# Altium schematic sheet USB_Debug.SchDoc: Dahlia Carrier Board
size A3; Organization: Toradex AG; Address1: Ebenaustrasse 10; Address2: Horw; Address3: 6048; Address4: Switzerland; DocumentNumber: 19; Revision: V1.1; SheetNumber: 19; SheetTotal: 21; PageSetup: Record=PageOptions|CenterHorizontal=True|CenterVertical=True|PrintScale=0.71|XCorrection=1.00|YCorrection=1.00|PrintKind=1|BorderSize=5000000|LeftOffset=0|BottomOffset=0|Orientation=2|PaperLength=1000|PaperWidth=1000|Scale=100|PaperSource=15|PrintQuality=600|MediaType=1|DitherType=10|PaperKind=A4|PrintScaleMode=1
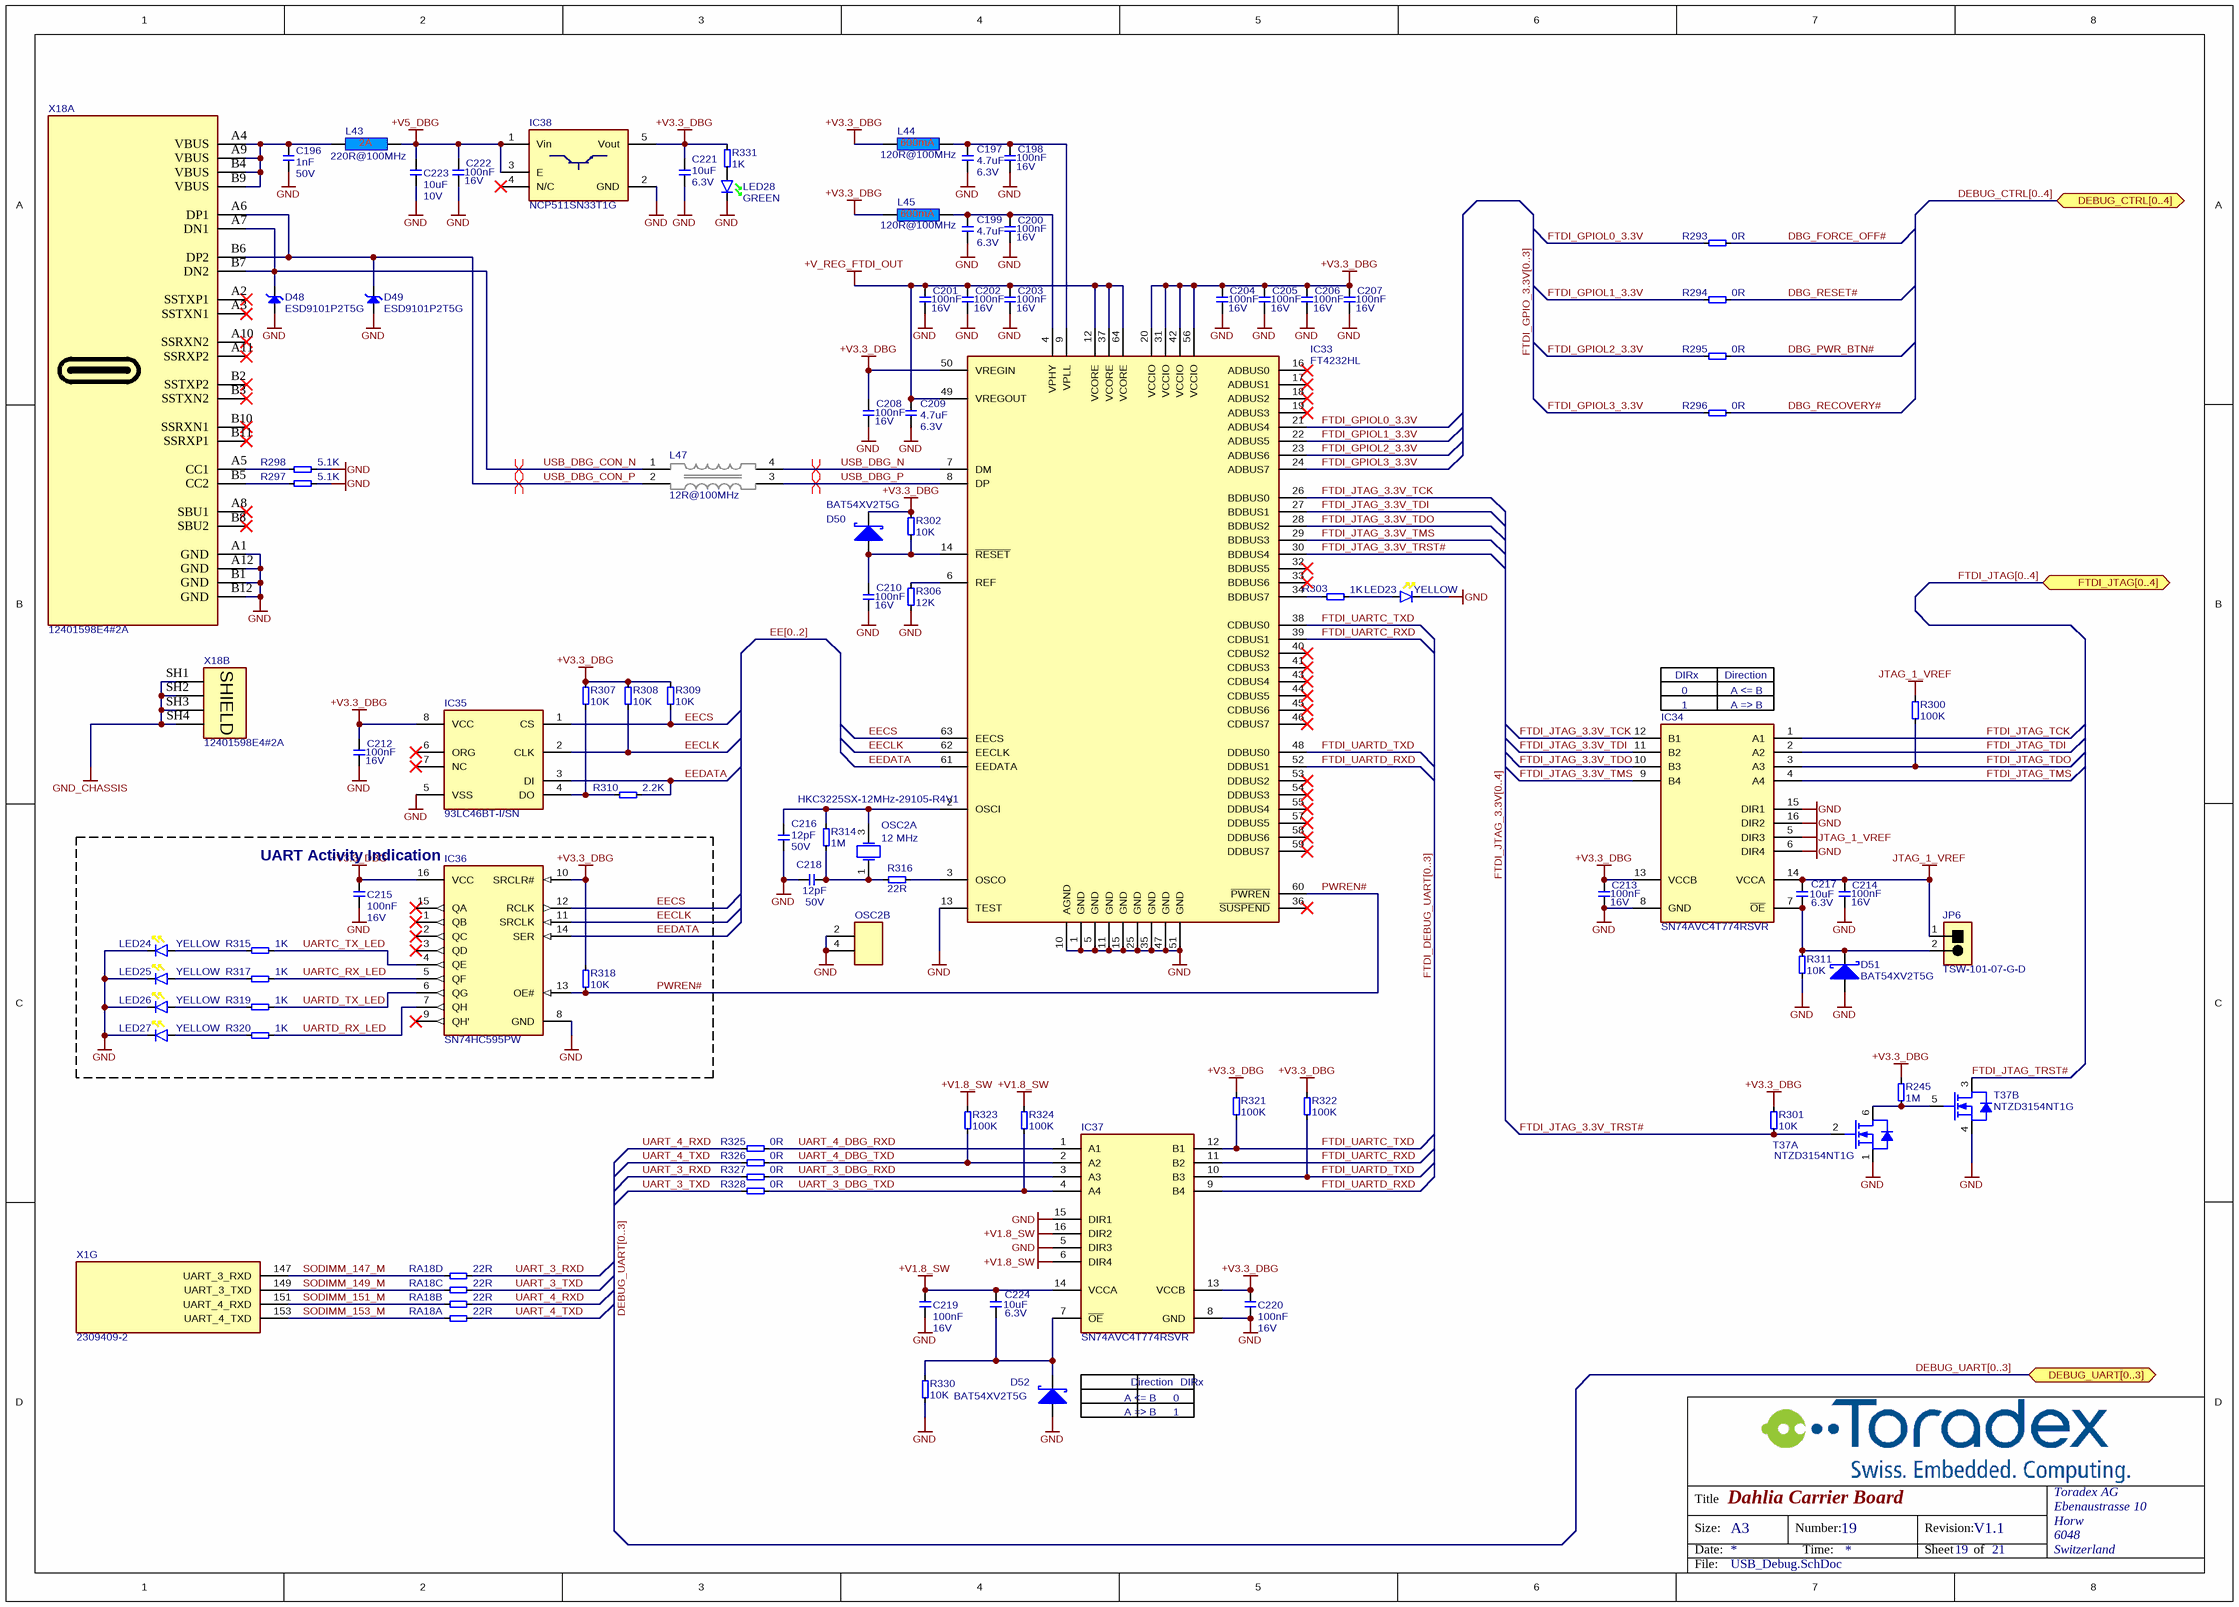
[diagram p0: USB_Debug.SchDoc]

## Parts
C196  Rating: 50V  [CAPC1005X60N]  (hidden comment: 1nF)
C197  Rating: 6.3V  [CAPC1005X60N]  (hidden comment: 4.7uF)
C198  Rating: 16V  [CAPC1005X60N]  (hidden comment: 100nF)
C199  Rating: 6.3V  [CAPC1005X60N]  (hidden comment: 4.7uF)
C200  Rating: 16V  [CAPC1005X60N]  (hidden comment: 100nF)
C201  Rating: 16V  [CAPC1005X60N]  (hidden comment: 100nF)
C202  Rating: 16V  [CAPC1005X60N]  (hidden comment: 100nF)
C203  Rating: 16V  [CAPC1005X60N]  (hidden comment: 100nF)
C204  Rating: 16V  [CAPC1005X60N]  (hidden comment: 100nF)
C205  Rating: 16V  [CAPC1005X60N]  (hidden comment: 100nF)
C206  Rating: 16V  [CAPC1005X60N]  (hidden comment: 100nF)
C207  Rating: 16V  [CAPC1005X60N]  (hidden comment: 100nF)
C208  Rating: 16V  [CAPC1005X60N]  (hidden comment: 100nF)
C209  Rating: 6.3V  [CAPC1005X60N]  (hidden comment: 4.7uF)
C210  Rating: 16V  [CAPC1005X60N]  (hidden comment: 100nF)
C212  Rating: 16V  [CAPC1005X60N]  (hidden comment: 100nF)
C213  Rating: 16V  [CAPC1005X60N]  (hidden comment: 100nF)
C214  Rating: 16V  [CAPC1005X60N]  (hidden comment: 100nF)
C215  Rating: 16V  [CAPC1005X60N]  (hidden comment: 100nF)
C216  Rating: 50V  [CAPC1005X60N]  (hidden comment: 12pF)
C217  Rating: 6.3V  [CAPC1005X60N]  (hidden comment: 10uF)
C218  Rating: 50V  [CAPC1005X60N]  (hidden comment: 12pF)
C219  Rating: 16V  [CAPC1005X60N]  (hidden comment: 100nF)
C220  Rating: 16V  [CAPC1005X60N]  (hidden comment: 100nF)
C221  Rating: 6.3V  [CAPC1005X60N]  (hidden comment: 10uF)
C222  Rating: 16V  [CAPC1005X60N]  (hidden comment: 100nF)
C223  Rating: 10V  [T_CAPC0603X33N]  (hidden comment: 10uF)
C224  Rating: 6.3V  [CAPC1005X60N]  (hidden comment: 10uF)
D48  ESD9101P2T5G  [SOD-923]
D49  ESD9101P2T5G  [SOD-923]
D50  BAT54XV2T5G  [SOD-523]
D51  BAT54XV2T5G  [SOD-523]
D52  BAT54XV2T5G  [SOD-523]
IC33  FT4232HL  [LQFP-64]
IC34  SN74AVC4T774RSVR  [IC-UQFN40P180X210X55-16N]
IC35  Manufacturer Part No.: 93LC46BT-I/SN  [SOIC127P600X173-8N]  (hidden comment: 93LC46BT)
IC36  SN74HC595PW  [IC_TSOP65P640X120-16N]
IC37  SN74AVC4T774RSVR  [IC-UQFN40P180X210X55-16N]
IC38  NCP511SN33T1G  [SOT95P279X142-5N]
JP6  TSW-101-07-G-D  [T_Samtec_TSW-101-07-G-D]
L43  220R@100MHz  [INDC1608X95N]
L44  120R@100MHz  [INDC1005X60N]
L45  120R@100MHz  [INDC1005X60N]
L47  12R@100MHz  [T_Panasonic_EXC14CH120U]
LED23  Color: YELLOW  [T_Liteon_LTST-C190KSKT]  (hidden comment: LTST-C190KSKT)
LED24  Color: YELLOW  [T_Liteon_LTST-C190KSKT]  (hidden comment: LTST-C190KSKT)
LED25  Color: YELLOW  [T_Liteon_LTST-C190KSKT]  (hidden comment: LTST-C190KSKT)
LED26  Color: YELLOW  [T_Liteon_LTST-C190KSKT]  (hidden comment: LTST-C190KSKT)
LED27  Color: YELLOW  [T_Liteon_LTST-C190KSKT]  (hidden comment: LTST-C190KSKT)
LED28  Color: GREEN  [T_Liteon_LTST-C190GKT]  (hidden comment: LTST-C190GKT)
OSC2  HKC3225SX-12MHz-29105-R4V1  value 12 MHz  [OSC-SMD-3.2mmx2.5mm]  (parts A,B of 2)
R245  1M  [RESC1005X40N]
R293  0R  [T_RESC0603X30N]
R294  0R  [T_RESC0603X30N]
R295  0R  [T_RESC0603X30N]
R296  0R  [T_RESC0603X30N]
R297  5.1K  [T_RESC0603X30N]
R298  5.1K  [T_RESC0603X30N]
R300  100K  [RESC1005X40N]
R301  10K  [RESC1005X40N]
R302  10K  [RESC1005X40N]
R303  1K  [RESC1005X40N]
R306  12K  [RESC1005X40N]
R307  10K  [RESC1005X40N]
R308  10K  [RESC1005X40N]
R309  10K  [RESC1005X40N]
R310  2.2K  [RESC1005X40N]
R311  10K  [RESC1005X40N]
R314  value 1M  [T_RESC0603X30N]  (hidden comment: 1MR)
R315  1K  [RESC1005X40N]
R316  22R  [RESC1005X40N]
R317  1K  [RESC1005X40N]
R318  10K  [RESC1005X40N]
R319  1K  [RESC1005X40N]
R320  1K  [RESC1005X40N]
R321  100K  [RESC1005X40N]
R322  100K  [RESC1005X40N]
R323  100K  [RESC1005X40N]
R324  100K  [RESC1005X40N]
R325  0R  [T_RESC0603X30N]
R326  0R  [T_RESC0603X30N]
R327  0R  [T_RESC0603X30N]
R328  0R  [T_RESC0603X30N]
R330  10K  [RESC1005X40N]
R331  1K  [RESC1005X40N]
RA18  22R  [T_Resistor_Array_X4]  (parts A,B,C,D of 4)
T37  Manufacturer Part No.: NTZD3154NT1G  [SOTFL50P160X60-6N]  (hidden comment: T-ONSemi-NTZD3154NT1G)  (parts A,B of 2)
X1  2309409-2  [CON-TE-2309409-2-SOLDERABLE-STANDOFFS]  (part G of 23)
X18  12401598E4#2A  [CON-AMPHENOL-12401598E4#2A]  (parts A,B of 2)

## Blocks framed on the sheet
UART Activity Indication: C215 IC36 LED24-LED27 R315 R317-R320

## Ports
DEBUG_CTRL[0..4] (bidir), DEBUG_UART[0..3] (bidir), FTDI_JTAG[0..4] (bidir)

## Nets
+V1.8_SW: C219.2 C224.2 IC37.6(DIR4) IC37.14(VCCA) IC37.16(DIR2) R323.1 R324.2
+V3.3_DBG: C204.2 C205.2 C206.2 C207.2 C208.2 C212.2 C213.2 C215.2 C220.2 C221.2 D50.C IC33.20(VCCIO) IC33.31(VCCIO) IC33.42(VCCIO) IC33.50(VREGIN) IC33.56(VCCIO) IC34.13(VCCB) IC35.8(VCC) IC36.10(SRCLR#) IC36.16(VCC) IC37.13(VCCB) IC38.5(Vout) L44.1 L45.1 R245.2 R301.2 R302.2 R307.2 R308.2 R309.2 R318.2 R321.1 R322.2 R331.2
+V5_DBG: C222.2 C223.2 IC38.1(Vin) IC38.3(E) L43.1
+V_REG_FTDI_OUT: C201.2 C202.2 C203.2 C209.2 IC33.12(VCORE) IC33.37(VCORE) IC33.49(VREGOUT) IC33.64(VCORE)
GND: C196.1 C197.1 C198.1 C199.1 C200.1 C201.1 C202.1 C203.1 C204.1 C205.1 C206.1 C207.1 C208.1 C209.1 C210.1 C212.1 C213.1 C214.1 C215.1 C216.2 C218.1 C219.1 C220.1 C221.1 C222.1 C223.1 D48.2(A) D49.2(A) D51.A D52.A IC33.1(GND) IC33.5(GND) IC33.10(AGND) IC33.11(GND) IC33.13(TEST) IC33.15(GND) IC33.25(GND) IC33.35(GND) IC33.47(GND) IC33.51(GND) IC34.6(DIR4) IC34.8(GND) IC34.15(DIR1) IC34.16(DIR2) IC35.5(VSS) IC36.8(GND) IC37.5(DIR3) IC37.8(GND) IC37.15(DIR1) IC38.2(GND) LED23.K LED24.K LED25.K LED26.K LED27.K LED28.K OSC2.2(OSC2) OSC2.4(OSC3) R297.1 R298.1 R306.1 R311.1 R330.1 T37.1(S) T37.4(S) X18.A1(GND) X18.A12(GND) X18.B1(GND) X18.B12(GND)
GND_CHASSIS: X18.SH1(SHIELD) X18.SH2(SHIELD) X18.SH3(SHIELD) X18.SH4(SHIELD)
JTAG_1_VREF: C214.2 C217.2 IC34.5(DIR3) IC34.14(VCCA) JP6.1 R300.2
DBG_FORCE_OFF#: R293.2
DBG_PWR_BTN#: R295.2
DBG_RECOVERY#: R296.2
DBG_RESET#: R294.2
EECLK: IC33.62(EECLK) IC35.2(CLK) IC36.11(SRCLK) R308.1
EECS: IC33.63(EECS) IC35.1(CS) IC36.12(RCLK) R309.1
EEDATA: IC33.61(EEDATA) IC35.3(DI) IC36.14(SER) R310.2
FTDI_GPIOL0_3.3V: IC33.21(ADBUS4) R293.1
FTDI_GPIOL1_3.3V: IC33.22(ADBUS5) R294.1
FTDI_GPIOL2_3.3V: IC33.23(ADBUS6) R295.1
FTDI_GPIOL3_3.3V: IC33.24(ADBUS7) R296.1
FTDI_JTAG_3.3V_TCK: IC33.26(BDBUS0) IC34.12(B1)
FTDI_JTAG_3.3V_TDI: IC33.27(BDBUS1) IC34.11(B2)
FTDI_JTAG_3.3V_TDO: IC33.28(BDBUS2) IC34.10(B3)
FTDI_JTAG_3.3V_TMS: IC33.29(BDBUS3) IC34.9(B4)
FTDI_JTAG_3.3V_TRST#: IC33.30(BDBUS4) R301.1 T37.2(G)
FTDI_JTAG_TCK: IC34.1(A1)
FTDI_JTAG_TDI: IC34.2(A2)
FTDI_JTAG_TDO: IC34.3(A3) R300.1
FTDI_JTAG_TMS: IC34.4(A4)
FTDI_JTAG_TRST#: T37.3(D)
FTDI_UARTC_RXD: IC33.39(CDBUS1) IC37.11(B2)
FTDI_UARTC_TXD: IC33.38(CDBUS0) IC37.12(B1) R321.2
FTDI_UARTD_RXD: IC33.52(DDBUS1) IC37.9(B4)
FTDI_UARTD_TXD: IC33.48(DDBUS0) IC37.10(B3) R322.1
PWREN#: IC33.60(~{PWREN}) IC36.13(OE#) R318.1
SODIMM_147_M: RA18.4 X1.147(UART_3_RXD)
SODIMM_149_M: RA18.3 X1.149(UART_3_TXD)
SODIMM_151_M: RA18.2 X1.151(UART_4_RXD)
SODIMM_153_M: RA18.1 X1.153(UART_4_TXD)
UART_3_DBG_RXD: IC37.3(A3) R327.2
UART_3_DBG_TXD: IC37.4(A4) R324.1 R328.2
UART_3_RXD: R327.1 RA18.8
UART_3_TXD: R328.1 RA18.7
UART_4_DBG_RXD: IC37.1(A1) R325.2
UART_4_DBG_TXD: IC37.2(A2) R323.2 R326.2
UART_4_RXD: R325.1 RA18.6
UART_4_TXD: R326.1 RA18.5
UARTC_RX_LED: IC36.5(QF) R317.2
UARTC_TX_LED: IC36.4(QE) R315.2
UARTD_RX_LED: IC36.7(QH) R320.2
UARTD_TX_LED: IC36.6(QG) R319.2
USB_DBG_CON_N: D48.1(C) L47.1 X18.A7(DN1) X18.B7(DN2)
USB_DBG_CON_P: D49.1(C) L47.2 X18.A6(DP1) X18.B6(DP2)
USB_DBG_N: IC33.7(DM) L47.4
USB_DBG_P: IC33.8(DP) L47.3
NetC196_2: C196.2 L43.2 X18.A4(VBUS) X18.A9(VBUS) X18.B4(VBUS) X18.B9(VBUS)
NetC197_2: C197.2 C198.2 IC33.9(VPLL) L44.2
NetC199_2: C199.2 C200.2 IC33.4(VPHY) L45.2
NetC210_2: C210.2 D50.A IC33.14(~{RESET}) R302.1
NetC216_1: C216.1 IC33.2(OSCI) OSC2.3(OSC2) R314.2
NetC217_1: C217.1 D51.C IC34.7(~{OE}) JP6.2 R311.2
NetC218_2: C218.2 OSC2.1(OSC1) R314.1 R316.2
NetC224_1: C224.1 D52.C IC37.7(~{OE}) R330.2
NetIC33_3: IC33.3(OSCO) R316.1
NetIC33_6: IC33.6(REF) R306.2
NetIC33_34: IC33.34(BDBUS7) R303.2
NetIC35_4: IC35.4(DO) R307.1 R310.1
NetLED23_A: LED23.A R303.1
NetLED24_A: LED24.A R315.1
NetLED25_A: LED25.A R317.1
NetLED26_A: LED26.A R319.1
NetLED27_A: LED27.A R320.1
NetLED28_A: LED28.A R331.1
NetR245_1: R245.1 T37.5(G) T37.6(D)
NetR297_2: R297.2 X18.B5(CC2)
NetR298_2: R298.2 X18.A5(CC1)

Not connected (* = marked no-connect by the designer): IC33 16(ADBUS0)* 17(ADBUS1)* 18(ADBUS2)* 19(ADBUS3)* 32(BDBUS5)* 33(BDBUS6)* 36(~{SUSPEND})* 40(CDBUS2)* 41(CDBUS3)* 43(CDBUS4)* 44(CDBUS5)* 45(CDBUS6)* 46(CDBUS7)* 53(DDBUS2)* 54(DDBUS3)* 55(DDBUS4)* 57(DDBUS5)* 58(DDBUS6)* 59(DDBUS7)*; IC35 6(ORG)* 7(NC)*; IC36 1(QB)* 2(QC)* 3(QD)* 9(QH')* 15(QA)*; IC38 4(N/C)*; X18 A2(SSTXP1)* A3(SSTXN1)* A8(SBU1)* A10(SSRXN2)* A11(SSRXP2)* B2(SSTXP2)* B3(SSTXN2)* B8(SBU2)* B10(SSRXN1)* B11(SSRXP1)*

## Buses and harness runs
bus DEBUG_CTRL[0..4] = port DEBUG_CTRL[0..4]
bus DEBUG_UART[0..3] = port DEBUG_UART[0..3]
bus EE[0..2]
bus FTDI_DEBUG_UART[0..3]
bus FTDI_GPIO_3.3V[0..3]
bus FTDI_JTAG[0..4] = port FTDI_JTAG[0..4]
bus FTDI_JTAG_3.3V[0..4]

## Layout directives
differential pair; differential pair class USB: USB_DBG_CON_N, USB_DBG_CON_P, USB_DBG_N, USB_DBG_P

## Notes on the sheet
- DIRx
- (near IC34) 0
- (near IC34) 1
- Direction
- (near IC34) A <= B
- (near IC34) A => B
- (near D52) A <= B
- (near D52) A => B
- (near D52) Direction
- 0
- 1
- (near IC37) DIRx
- Title
- Size:
- Date:
- A3
- Number:
- Time:
- Revision:
- Sheet
- of
- File:

## Library data of the parts
C196 = C-X7R-1nF-50V-10%-0402: Capacitor Ceramic X7R 1nF 50V 10% 0402; Tolerance: 10%; Type: X7R; Value: 1nF
C197 C199 C209 = C-X5R-4.7u-6.3V-20%-0402: Capacitor Ceramic X5R 4.7uF 6.3V 20% 0402; Tolerance: 20%; Type: X5R; Value: 4.7uF
C198 C200-C208 C210 C212-C215 C219 C220 C222 = C-X7R-100nF-16V-10%-0402: Capacitor Ceramic X7R 100nF 16V 10% 0402; Tolerance: 10%; Type: X7R; Value: 100nF
C216 C218 = C-NP0-12p-50V-5%-0402: Capacitor Ceramic NP0  12pF 50V 5% 0402; Tolerance: 5%; Type: NP0; Value: 12pF
C217 C221 C224 = C-X5R-10u-6.3V-20%-0402: Capacitor Ceramic X5R 10uF 6.3V 20% 0402; Tolerance: 20%; Type: X5R; Value: 10uF
C223 = C-X5R-10uF-10V-20%-0603: Capacitor Ceramic X5R 10uF 10V 20% 0603; Tolerance: 20%; Type: X5R; Value: 10uF
D48 D49 = D-OnSemi-ESD9101P2T5G: ESD Protection Diode; Manufacturer Name: OnSemi; Manufacturer Part No.: ESD9101P2T5G
D50-D52 = D-BAT54-SOD523: Schottky Barrier Rectifier; Manufacturer Name: On Semi; Manufacturer Part No.: BAT54XV2T5G
IC33 = IC-FTDI-FT4232HL: Quad High Speed USB to Multipurpose UART/MPSSE; Manufacturer Name: FTDI; Note: Quad USB to UART; Manufacturer Part No.: FT4232HL
IC34 IC37 = IC-TI-SN74AVC4T774RSVR: 4 Bit Bidirectional l Voltage Level Translator, Configurable Direction, UFQFN-16 package; Manufacturer Name: Texas Instruments; Manufacturer Part No.: SN74AVC4T774RSVR
IC35 = IC-MC-93LC46BT-I/SN: EEPROM, 1k, 64x16, serial, SOIC8; Manufacturer Name: Microchip
IC36 = IC-TI-SN74HC595PW: 8-Bit Shift Registers With 3-State Output Registers; Manufacturer Name: Texas Instruments; Manufacturer Part No.: SN74HC595PW
IC38 = IC-ON-NCP511SN33T1G: NCP511SN33T1G LDO Regulator; Manufacturer Name: ON Semiconductor; Manufacturer Part No.: NCP511SN33T1G
JP6 = CON-Samtec-TSW-101-07-G-D: Header male, 1x2 Pins, 2.54 mm pitch; Manufacturer Name: Samtec; Pitch: 2.54 mm; No. of ways: 1x2; Manufacturer Part no.: TSW-101-07-G-D
L43 = L-220R@100MHz-2A-25%-0603: 220R@100MHz 2A EMI FILTER; Tolerance: 25%; Rating: 2A; Value: 220R@100MHz
L44 L45 = Lemv-120R-600mA-25%-0402: 120R@100MHz 600mA EMI FILTER; Tolerance: 25%; Rating: 600mA; Value: 120R@100MHz
L47 = L-Panasonic-EXC14CH120U-12R@100MHz-1000mA-25%: Common Mode Choke High Speed 12R 100mA; Tolerance: 25%; Rating: 100mA; Manufacturer Name: Panasonic; Manufacturer Part No.: EXC14CH120U; Value: 12R@100MHz
LED23-LED27 = LED-LiteOn-LTST-C190KSKT: LED yellow Lite-On LTST-C190KSKT; Manufacturer Name: Lite-On; Manufacturer Part No.: LTST-C190KSKT
LED28 = LED-LiteOn-LTST-C190GKT: LED green Lite-ON LTST-C190GKT; Manufacturer Name: Lite-ON; Manufacturer Part No.: LTST-C190GKT
OSC2 = OSC-HKC-HKC3225SX-12MHz-29105-R4V1: 12MHz Ceramic SMD Crystal, Hong Kong X’tals Limited, HKC3225SX-12MHz-29105-R4V1, 30ppm, -40C to +85C; Tolerance: +/- 30 ppm; Manufacturer Name: Hong Kong X’tals Limited; Package: 3.2mm X 2.5mm; Temperature Range: -40C to +85C; Manufacturer Part No.: HKC3225SX-12MHz-29105-R4V1
R245 = R-1M-63mW-5%-0402: Resistor 1 Mohm 63mW 5% 0402; Rating: 63mW; Tolerance: 5%; Value: 1M
R293-R296 R325-R328 = R-0R-63mW-1%-0603: Resistor 0 ohm 63mW 1% 0603; Rating: 63mW; Tolerance: 1%; Value: 0R
R297 R298 = R-5.1K-63mW-1%-0603: Resistor 5.1 Kohm 63mW 1% 0603; Rating: 63mW; Tolerance: 1%; Value: 5.1K
R300 R321-R324 = R-100K-63mW-5%-0402: Resistor 100 Kohm 63mW 5% 0402; Rating: 63mW; Tolerance: 5%; Value: 100K
R301 R302 R307-R309 R311 R318 R330 = R-10K-63mW-5%-0402: Resistor 10 Kohm 63mW 5% 0402; Rating: 63mW; Tolerance: 5%; Value: 10K
R303 R315 R317 R319 R320 R331 = R-1K-63mW-5%-0402: Resistor 1 Kohm 63mW 5% 0402; Rating: 63mW; Tolerance: 5%; Value: 1K
R306 = R-12K-63mW-1%-0402: Resistor 12 Kohm 63mW 1% 0402; Rating: 63mW; Tolerance: 1%; Value: 12K
R310 = R-2.2K-63mW-5%-0402: Resistor 2.2 Kohm 63mW 5% 0402; Value: 2.2KR; Rating: 63mW; Tolerance: 5%
R314 = R-1M-63mW-5%-0603: Resistor 1Mohm 63mW 5% 0603; Rating: 63mW; Tolerance: 5%
R316 = R-22R-63mW-5%-0402: Resistor 22 ohm 63mW 5% 0402; Rating: 63mW; Tolerance: 5%; Value: 22R
RA18 = RA-22R-63mW-5%-1206-div: Resistor Array 22 R 63mW 5% 1206; Tolerance: 5%; Power Dissipation: 63mW; Value: 22R
T37 = T-ONSemi-NTZD3154NT1G: Dual N-Channel 20V (D-S)  MOSFET; Manufacturer Name: ONSemi
X1 = CON-TE-2309409-2: DDR4 SODIMM Socket, 260 pins, 5.2mm(H), 0.5mm Pitch; Manufacturer Name: TE; Temperature Range: -40C to +125C; Package: DDR4-SODIMM-260; Manufacturer Part No.: 2309409-2
X18 = CON-Amphenol-12401598E4#2A: USB 3.1 Gen 2, Input Output Connectors, USB type C, Receptacle, Top mount, dual-row SMT, 1.6mmPCB; No. of ways: 24; Manufacturer Name: Amphenol; Manufacturer Part No.: 12401598E4#2A